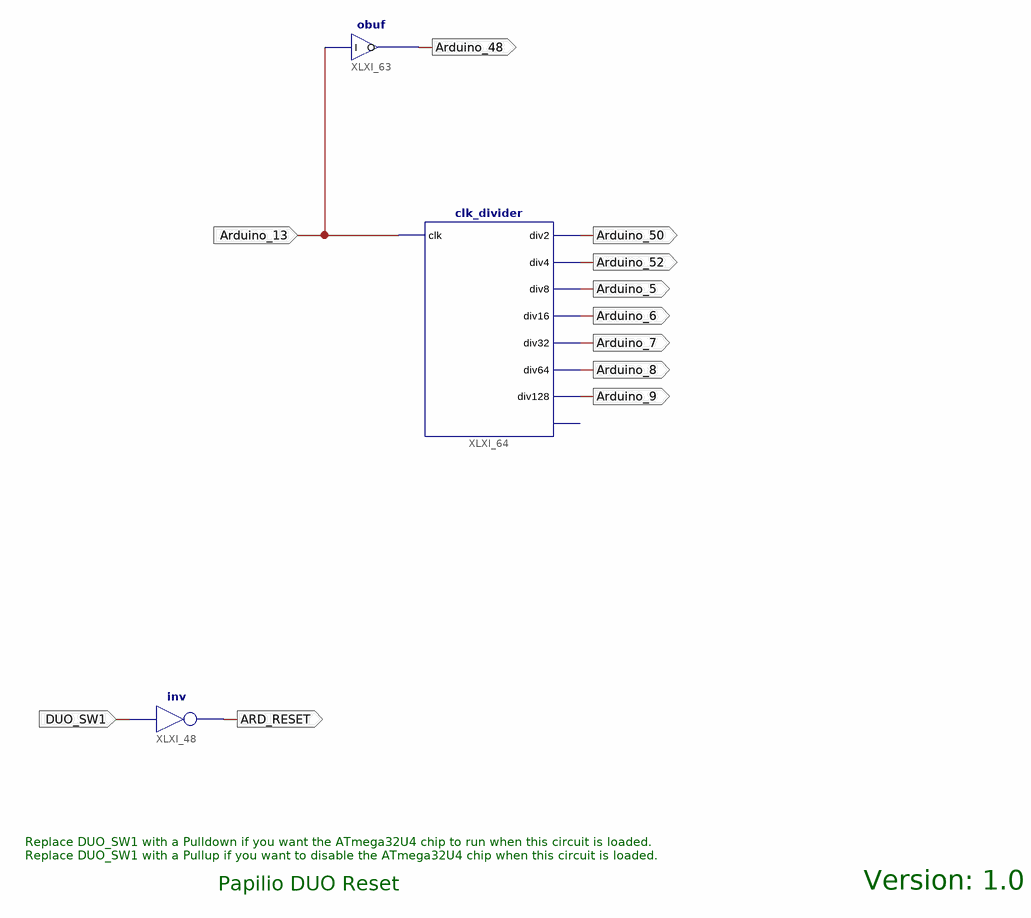
[diagram p0: schematic sheet 1]
// Xilinx ISE schematic Papilio_DUO_LX9.sch (spartan6) as structural Verilog: 3 symbols, 11 ports
module Papilio_DUO_LX9 (
  input  DUO_SW1,
  input  Arduino_13,
  output ARD_RESET,
  output Arduino_48,
  output Arduino_50,
  output Arduino_52,
  output Arduino_5,
  output Arduino_6,
  output Arduino_7,
  output Arduino_8,
  output Arduino_9
);

  not XLXI_48 (ARD_RESET, DUO_SW1);
  obuf XLXI_63 (.I(Arduino_13), .O(Arduino_48));
  clk_divider XLXI_64 (
    .clk(Arduino_13), .div2(Arduino_50), .div4(Arduino_52), .div8(Arduino_5), .div16(Arduino_6),
    .div32(Arduino_7), .div64(Arduino_8), .div128(Arduino_9));  // open: div256

  // Notes on the sheet:
  //   Replace DUO_SW1 with a Pulldown if you want the ATmega32U4 chip to run when this circuit is loaded.
  //   Replace DUO_SW1 with a Pullup if you want to disable the ATmega32U4 chip when this circuit is loaded.
  //   Version: 1.0
  //   Papilio DUO Reset
endmodule
